# EAGLE schematic ECE411 Practicum Schematic (EAGLE 9.6.2)
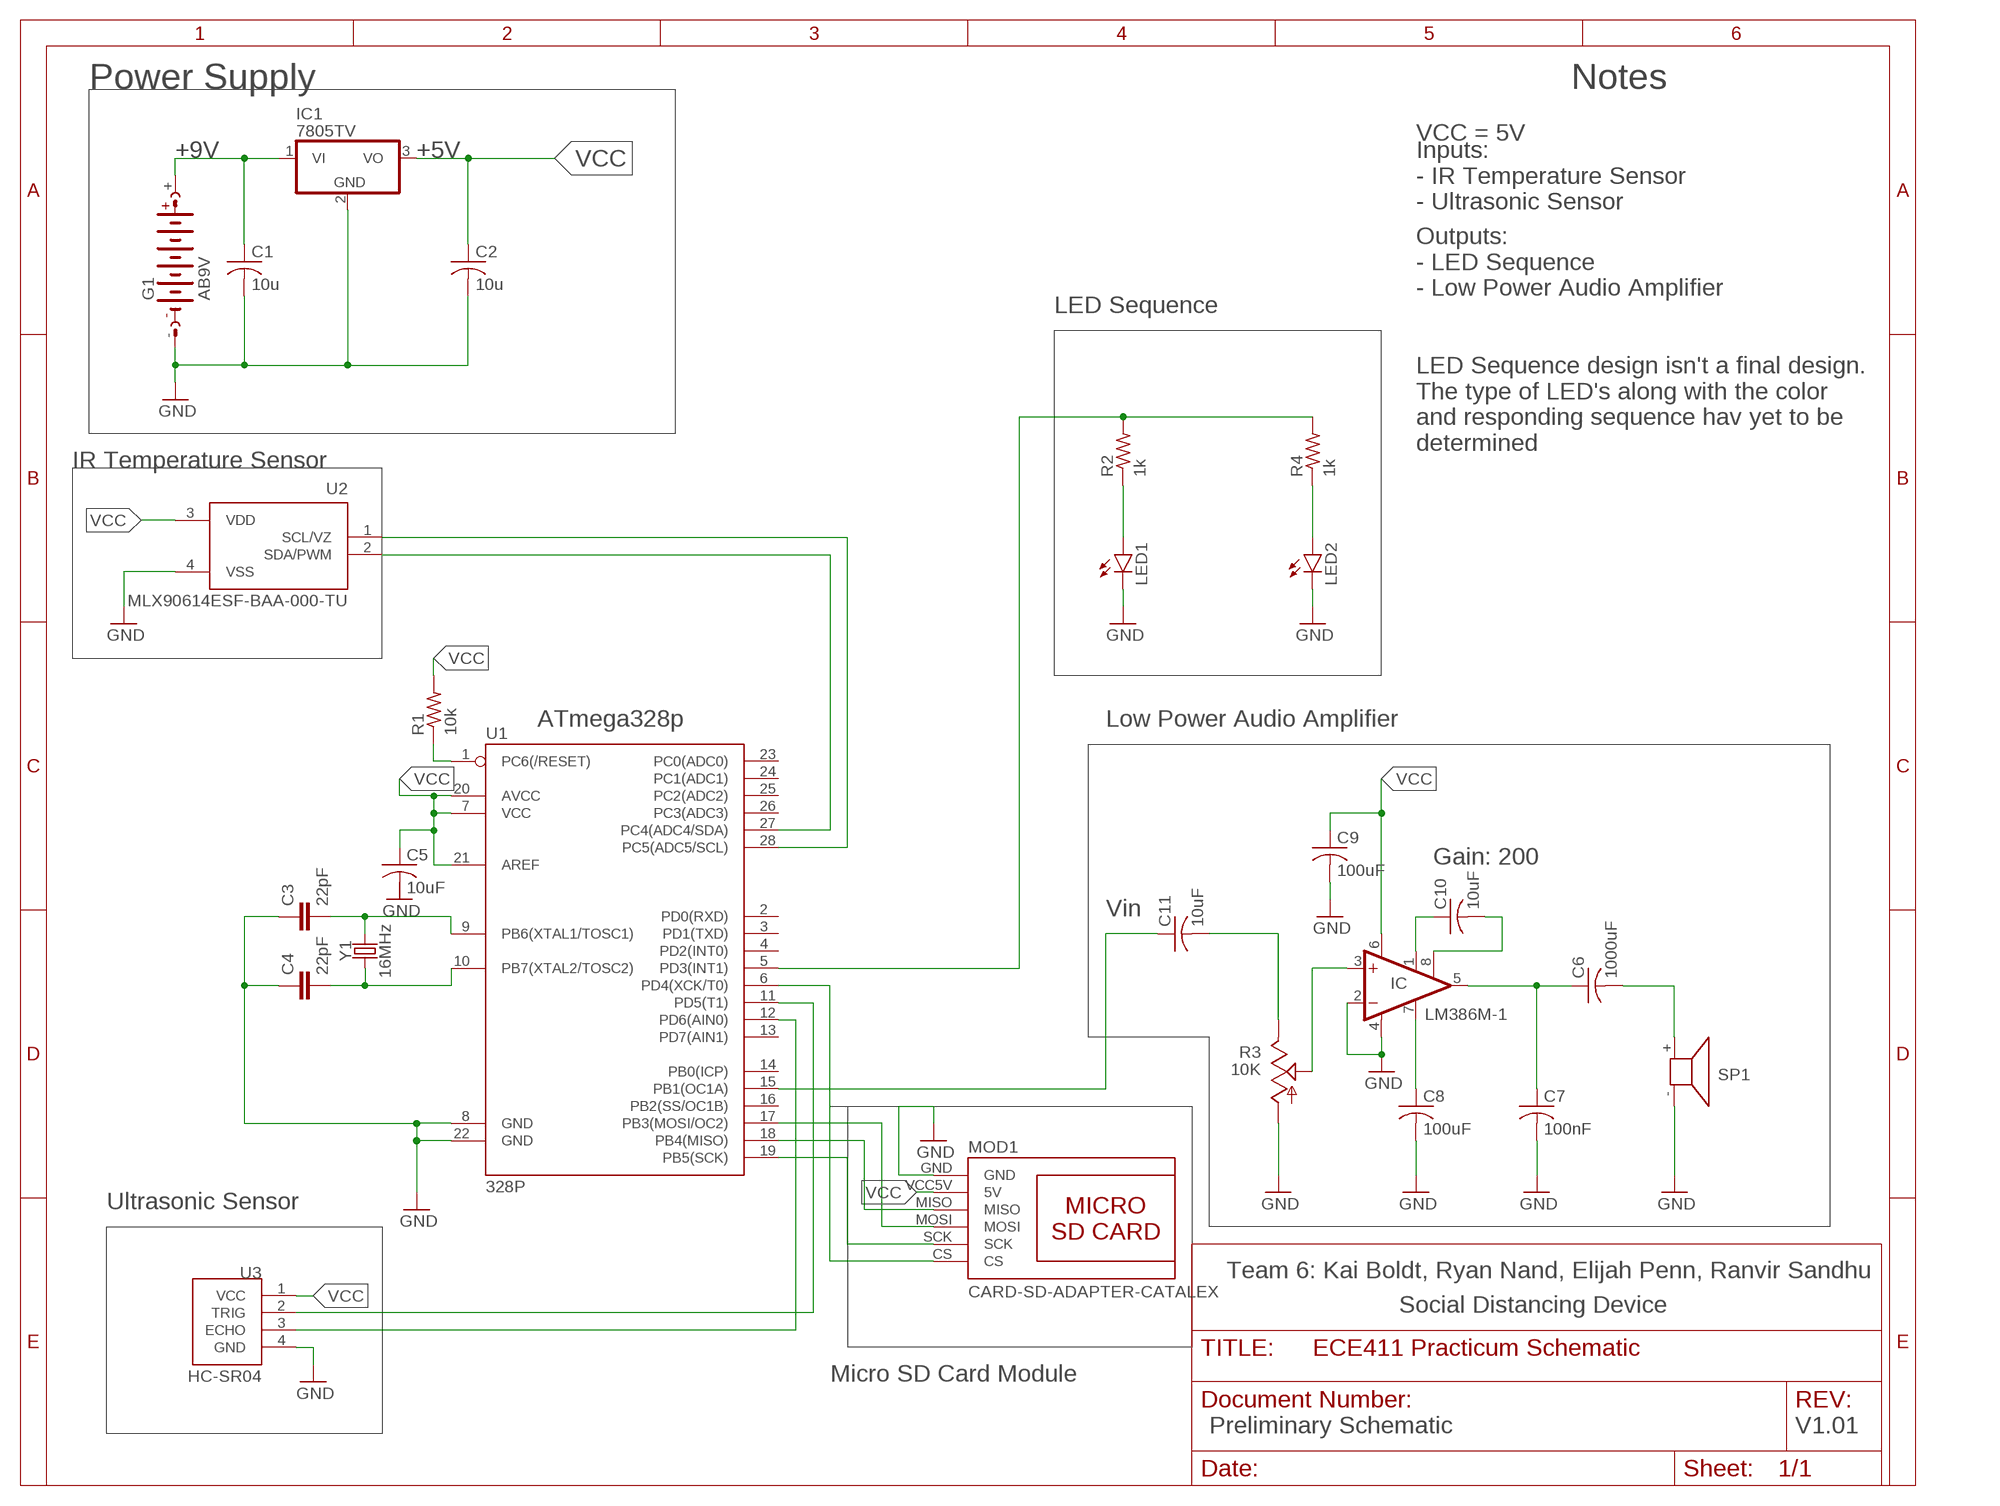
[diagram p0: schematic, sheet 1]

## Parts
C1  10u  C-US050-030X075  [C050-030X075]
C2  10u  C-US050-030X075  [C050-030X075]
C3  22pF  22PF-PTH-2.54MM-200V-5%  [CAP-PTH-2.54]
C4  22pF  22PF-PTH-2.54MM-200V-5%  [CAP-PTH-2.54]
C5  10uF  C-US050-024X044  [C050-024X044]
C6  1000uF  C-US025-024X044  [C025-024X044]
C7  100nF  C-US025-024X044  [C025-024X044]
C8  100uF  C-US025-024X044  [C025-024X044]
C9  100uF  C-US025-024X044  [C025-024X044]
C10  10uF  C-US025-024X044  [C025-024X044]
C11  10uF  C-US025-024X044  [C025-024X044]
G1  AB9V  [AB9V]
IC  LM386M-1  [SO08]
IC1  7805TV  [TO220V]
LED1  LED3MM  [LED3MM]
LED2  LED3MM  [LED3MM]
MOD1  CARD-SD-ADAPTER-CATALEX  [CARD-SD-ADAPTER-CATALEX]
R1  10k  R-US_0204/5  [0204/5]
R2  1k  R-US_0204/5  [0204/5]
R3  10K  TRIM_US-3223G  [3223G]
R4  1k  R-US_0204/5  [0204/5]
SP1  KSS1201  [KSS1201]
U1  328P  ATMEGA328P_PDIP  [DIP28]
U2  MLX90614ESF-BAA-000-TU  [TO254P942H425-4]
U3  HC-SR04  [XCVR_HC-SR04]
Y1  16MHz  CRYSTAL-16MHZPTH-HC49US  [HC49US]

## Nets
+9V: C1.1 G1.+ IC1.1(VI)
GND: C1.2 C2.2 C3.1 C4.1 C7.2 C8.2 C9.2 G1.- IC1.2(GND) IC.2(-IN) IC.4(GND) LED1.K(C) LED2.K(C) MOD1.GND R3.1(A) SP1.- U1.8(GND) U1.22(GND) U2.4(VSS) U3.4(GND)
N$1: C3.2 U1.9(PB6(XTAL1/TOSC1)) Y1.2
N$2: R1.1 U1.1(PC6(/RESET))
N$3: C4.2 U1.10(PB7(XTAL2/TOSC2)) Y1.1
N$4: MOD1.CS U1.6(PD4(XCK/T0))
N$6: U1.27(PC4(ADC4/SDA)) U2.2(SDA/PWM)
N$7: MOD1.SCK U1.19(PB5(SCK))
N$8: C8.1 IC.7(BYPASS)
N$9: C6.1 C7.1 IC.5(OUT)
N$10: C10.2 IC.8(GAIN)
N$11: IC.3(+IN) R3.2(S)
N$12: C10.1 IC.1(GAIN)
N$13: C11.2 R3.3(E)
N$14: C11.1 U1.15(PB1(OC1A))
N$15: MOD1.MISO U1.18(PB4(MISO))
N$16: U1.28(PC5(ADC5/SCL)) U2.1(SCL/VZ)
N$17: MOD1.MOSI U1.17(PB3(MOSI/OC2))
N$18: U1.11(PD5(T1)) U3.2(TRIG)
N$19: U1.12(PD6(AIN0)) U3.3(ECHO)
N$20: R2.2 R4.2 U1.5(PD3(INT1))
N$21: LED1.A R2.1
N$22: LED2.A R4.1
VCC: C2.1 C5.1 C9.1 IC1.3(VO) IC.6(VS) MOD1.VCC5V(5V) R1.2 U1.7(VCC) U1.20(AVCC) U1.21(AREF) U2.3(VDD) U3.1(VCC)
VO: C6.2 SP1.+
Unconnected: C5.2 U1.2(PD0(RXD)) U1.3(PD1(TXD)) U1.4(PD2(INT0)) U1.13(PD7(AIN1)) U1.14(PB0(ICP)) U1.16(PB2(SS/OC1B)) U1.23(PC0(ADC0)) U1.24(PC1(ADC1)) U1.25(PC2(ADC2)) U1.26(PC3(ADC3))

## Notes on the sheet
- Power Supply | Notes
- VCC = 5V
- +5V
- Inputs:
  - IR Temperature Sensor
  - Ultrasonic Sensor
- Outputs:
  - LED Sequence
  - Low Power Audio Amplifier
- LED Sequence
- LED Sequence design isn't a final design.
  The type of LED's along with the color 
  and responding sequence hav yet to be 
  determined
- IR Temperature Sensor
- ATmega328p | Low Power Audio Amplifier
- Gain: 200
- Vin
- Ultrasonic Sensor
- Team 6: Kai Boldt, Ryan Nand, Elijah Penn, Ranvir Sandhu
- Social Distancing Device
- Micro SD Card Module
- Preliminary Schematic | V1.01

## Library data of the parts
C1 C2 C5-C11 = rcl:C-US: CAPACITOR, American symbol; SPICEPREFIX: C
C3 C4 = SparkFun-Capacitors:22PF: 22pF ceramic capacitors A capacitor is a passive two-terminal electrical component used to store electrical energy temporarily in an electric field.; PROD_ID: CAP-09128
G1 = battery:AB9V: 9-V BATTERY CLIP
IC = linear:LM386?-*: Low Voltage Audio Power Amplifier Source: http://cache.national.com/ds/LM/LM386.pdf
IC1 = linear:78*: Positive VOLTAGE REGULATOR Source: http://cache.national.com/ds/LM/LM78L05.pdf http://www.fairchildsemi.com/ds/LM/LM7805.pdf
LED1 LED2 = led:LED: LED OSRAM: - CHIPLED LG R971, LG N971, LY N971, LG Q971, LY Q971, LO R971, LY R971 LH N974, LH R974 LS Q976, LO Q976, LY Q976 LO Q996 - Hyper CHIPLED LW Q18S LB Q993, LB Q99A, LB R99A - SideLED LS A670, LO A670, LY A670, LG A670, LP A670 LB A673, LV A673, LT A673, LW A673 LH A674 LY A675 LS A676, LA A676, LO A676, LY A676, LW A676 LS A679, LY A679, LG A679 - Hyper Micro SIDELED® LS Y876, LA Y876, LO Y876, LY Y876 LT Y87S - SmartLED LW L88C, LW L88S LB L89C, LB L89S, LG L890 LS L89K, LO L89K, LY L89K LS L896, LA L896, LO L896, LY L896 - TOPLED LS T670, LO T670, LY T670, LG T670, LP T670 LSG T670, LSP T670, LSY T670, LOP T670, LYG T670 LG T671, LOG T671, LSG T671 LB T673, LV T673, LT T673, LW T673 LH T674 LS T676, LA T676, LO T676, LY T676, LB T676, LH T676, LSB T676, LW T676 LB T67C, LV T67C, LT T67C, LS T67K, LO T67K, LY T67K, LW E67C LS E67B, LA E67B, LO E67B, LY E67B, LB E67C, LV E67C, LT E67C LW T67C LS T679, LY T679, LG T679 LS T770, LO T770, LY T770, LG T770, LP T770 LB T773, LV T773, LT T773, LW T773 LH T774 LS E675, LA E675, LY E675, LS T675 LS T776, LA T776, LO T776, LY T776, LB T776 LHGB T686 LT T68C, LB T68C - Hyper Mini TOPLED® LB M676 - Mini TOPLED Santana® LG M470 LS M47K, LO M47K, LY M47K Source: http://www.osram.convergy.de LUXEON: - LUMILED® LXK2-PW12-R00, LXK2-PW12-S00, LXK2-PW14-U00, LXK2-PW14-V00 LXK2-PM12-R00, LXK2-PM12-S00, LXK2-PM14-U00 LXK2-PE12-Q00, LXK2-PE12-R00, LXK2-PE12-S00, LXK2-PE14-T00, LXK2-PE14-U00 LXK2-PB12-K00, LXK2-PB12-L00, LXK2-PB12-M00, LXK2-PB14-N00, LXK2-PB14-P00, LXK2-PB14-Q00 LXK2-PR12-L00, LXK2-PR12-M00, LXK2-PR14-Q00, LXK2-PR14-R00 LXK2-PD12-Q00, LXK2-PD12-R00, LXK2-PD12-S00 LXK2-PH12-R00, LXK2-PH12-S00 LXK2-PL12-P00, LXK2-PL12-Q00, LXK2-PL12-R00 Source: www.luxeon.com KINGBRIGHT: KA-3528ASYC Source: www.kingbright.com
MOD1 = SD-Card-Module_CATALEX:CARD-SD-ADAPTER-CATALEX: Micro SD Card Adapter Module with onboard 3.3V regulator
R1 R2 R4 = rcl:R-US_: RESISTOR, American symbol; SPICEPREFIX: R
R3 = pot:TRIM_US-: POTENTIOMETER
SP1 = buzzer:KSS1201: SPEAKER Source: Schukat; OC_FARNELL: unknown; OC_NEWARK: unknown
U1 = SparkFun-IC-Microcontroller:ATMEGA328P_PDIP: Atmel 328P Through hole ATMEGA328P uC used in the Arduino 32kb flash, 1k EEPROM, 2k SRAM Datasheet <http://www.sparkfun.com/datasheets/Components/SMD/ATMega328.pdf> SparkFun Products Storefront component: AVR 28 Pin 20MHz 32K 6A/D - ATMega328P <https://www.sparkfun.com/products/9061> (COM-09061) SparkFun Simon Says - Through-Hole Soldering Kit <https://www.sparkfun.com/products/10547> (KIT-10547) SparkFun Learn to Solder - Simon Says <https://www.sparkfun.com/products/13708> (KIT-13708) SparkFun BigTime Watch Kit <https://www.sparkfun.com/products/11734> (KIT-11734) SparkFun ClockIt <https://www.sparkfun.com/products/10930> (KIT-10930) SparkFun Serial Enabled LCD Kit <https://www.sparkfun.com/products/10097> (LCD-10097) SparkFun Simon Tilts - Through Hole Soldering Kit <https://www.sparkfun.com/products/12634> (KIT-12634) SparkFun Frequency Counter Kit <https://www.sparkfun.com/products/10140> (KIT-10140) FabFM Radio Kit <https://www.sparkfun.com/products/11043> (KIT-11043) SparkFun Binary Blaster Kit <https://www.sparkfun.com/products/12037> (KIT-12037) SparkFun Metro-Gnome <https://www.sparkfun.com/products/9236> (KIT-09236) ATmega328 with Arduino Optiboot (Uno) <https://www.sparkfun.com/products/10524> (DEV-10524); PROD_ID: IC-09136
U2 = MLX90614ESF-BAA-000-TU:MLX90614ESF-BAA-000-TU: Temperature Sensor Digital, Infrared (IR) -40°C ~ 85°C 16 b TO-39 Check prices <https://pricing.snapeda.com/parts/MLX90614ESF-BAA-000-TU/Melexis/view-part?ref=eda>; AVAILABILITY: Warning; DESCRIPTION: Temperature Sensor Digital, Infrared (IR) -40°C ~ 85°C 16 b TO-39; MF: Melexis; MP: MLX90614ESF-BAA-000-TU; PACKAGE: TO-39 Melexis; PRICE: None; PURCHASE-URL: https://pricing.snapeda.com/search/part/MLX90614ESF-BAA-000-TU/?ref=eda
U3 = HC-SR04:HC-SR04: Ultrasonic Sensor Module Check prices <https://pricing.snapeda.com/parts/HC-SR04/SparkFun%20Electronics/view-part?ref=eda>; AVAILABILITY: Warning; DESCRIPTION: HC-SR04 Ultrasonic Sensor Platform Evaluation Expansion Board; MF: SparkFun Electronics; MP: HC-SR04; PACKAGE: None; PRICE: None; PURCHASE-URL: https://pricing.snapeda.com/search/part/HC-SR04/?ref=eda
Y1 = SparkFun-Clocks:CRYSTAL-16MHZ: 16MHz Crystal Digikey Example <http://www.digikey.com/product-search/en?keywords=535-9122-1-ND> Frequency: 16MHz Frequency Stability: ±50ppm Frequency Tolerance: ±20ppm Load Capacitance: 18pF SparkFun Products: Pro Micro -5V/16MHz <https://www.sparkfun.com/products/12640> SparkFun Serial Enabled LCD Kit <https://www.sparkfun.com/products/10097>; PROD_ID: XTAL-08181; SF_ID: COM-00536